# Altium schematic sheet ALU_Adder.SchDoc
size B; Author: E. Sims; Organization: Let's Build Rockets Inc.; SheetNumber: 18; SheetTotal: 18
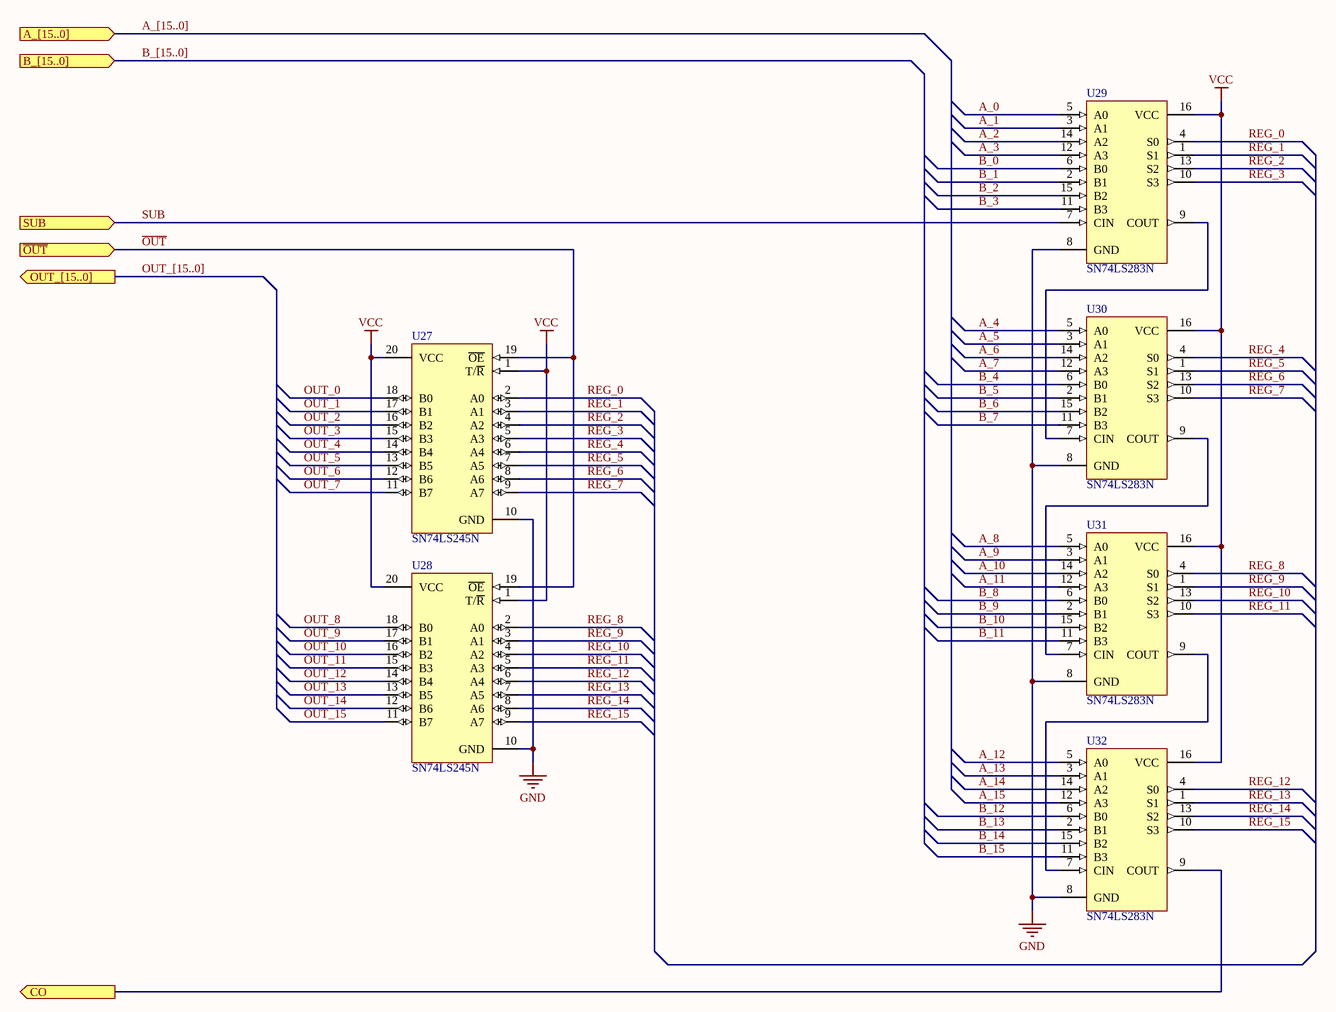
[diagram p0: ALU_Adder.SchDoc]

## Parts
U27  SN74LS245N  [N020]
U28  SN74LS245N  [N020]
U29  SN74LS283N  [W016]
U30  SN74LS283N  [W016]
U31  SN74LS283N  [W016]
U32  SN74LS283N  [W016]

## Ports
A_[15..0] (in), B_[15..0] (in), CO (out), OUT_[15..0] (out), SUB (in), ~{OUT} (in)

## Nets
GND: U27.10(GND) U28.10(GND) U29.8(GND) U30.8(GND) U31.8(GND) U32.8(GND)
VCC: U27.1(T/~{R}) U27.20(VCC) U28.1(T/~{R}) U28.20(VCC) U29.16(VCC) U30.16(VCC) U31.16(VCC) U32.16(VCC)
A_0: U29.5(A0)
A_1: U29.3(A1)
A_2: U29.14(A2)
A_3: U29.12(A3)
A_4: U30.5(A0)
A_5: U30.3(A1)
A_6: U30.14(A2)
A_7: U30.12(A3)
A_8: U31.5(A0)
A_9: U31.3(A1)
A_10: U31.14(A2)
A_11: U31.12(A3)
A_12: U32.5(A0)
A_13: U32.3(A1)
A_14: U32.14(A2)
A_15: U32.12(A3)
B_0: U29.6(B0)
B_1: U29.2(B1)
B_2: U29.15(B2)
B_3: U29.11(B3)
B_4: U30.6(B0)
B_5: U30.2(B1)
B_6: U30.15(B2)
B_7: U30.11(B3)
B_8: U31.6(B0)
B_9: U31.2(B1)
B_10: U31.15(B2)
B_11: U31.11(B3)
B_12: U32.6(B0)
B_13: U32.2(B1)
B_14: U32.15(B2)
B_15: U32.11(B3)
CO: U32.9(COUT) ; port CO
~{OUT}: U27.19(~{OE}) U28.19(~{OE}) ; port ~{OUT}
OUT_0: U27.18(B0)
OUT_1: U27.17(B1)
OUT_2: U27.16(B2)
OUT_3: U27.15(B3)
OUT_4: U27.14(B4)
OUT_5: U27.13(B5)
OUT_6: U27.12(B6)
OUT_7: U27.11(B7)
OUT_8: U28.18(B0)
OUT_9: U28.17(B1)
OUT_10: U28.16(B2)
OUT_11: U28.15(B3)
OUT_12: U28.14(B4)
OUT_13: U28.13(B5)
OUT_14: U28.12(B6)
OUT_15: U28.11(B7)
REG_0: U27.2(A0) U29.4(S0)
REG_1: U27.3(A1) U29.1(S1)
REG_2: U27.4(A2) U29.13(S2)
REG_3: U27.5(A3) U29.10(S3)
REG_4: U27.6(A4) U30.4(S0)
REG_5: U27.7(A5) U30.1(S1)
REG_6: U27.8(A6) U30.13(S2)
REG_7: U27.9(A7) U30.10(S3)
REG_8: U28.2(A0) U31.4(S0)
REG_9: U28.3(A1) U31.1(S1)
REG_10: U28.4(A2) U31.13(S2)
REG_11: U28.5(A3) U31.10(S3)
REG_12: U28.6(A4) U32.4(S0)
REG_13: U28.7(A5) U32.1(S1)
REG_14: U28.8(A6) U32.13(S2)
REG_15: U28.9(A7) U32.10(S3)
SUB: U29.7(CIN) ; port SUB
NetU29_9: U29.9(COUT) U30.7(CIN)
NetU30_9: U30.9(COUT) U31.7(CIN)
NetU31_9: U31.9(COUT) U32.7(CIN)

## Buses and harness runs
bus A_[15..0] = port A_[15..0]
bus B_[15..0] = port B_[15..0]
bus OUT_[15..0] = port OUT_[15..0]

## Notes on the sheet
- Let's Build Rocket's Inc. Modular Paylaod System Based on TMP-010 Rev
  For more information visit https://github.com/LetsBuildRockets/Modular-Payload-System
  This work is licensed under CC BY-NC 4.0. To view a copy of this license, visit https://creativecommons.org/licenses/by-nc/4.0
- Title
- Size:
- Date:
- Assembly Variant:
- B
- Number:
- Time:
- Revision:
- Sheet
- of
- Author:
- File:

## Library data of the parts
U27 U28 = SN74LS245N: Octal Bus Transceiver with 3-State Outputs; Published: 8-Jun-2000; LatestRevisionDate: 04-Mar-2005; LatestRevisionNote: Stylized 3D Model Added.; DatasheetVersion: Mar-1988; PackageVersion: Oct-1995; PackageReference: N020; Publisher: Altium Limited; PackageDescription: DIP; 20 Leads; Row Spacing 7.62 mm; Pitch 2.54 mm; ComponentLink1Description: Manufacturer Link; ComponentLink1URL: http://www.ti.com/; ComponentLink2Description: Datasheet; ComponentLink2URL: http://www-s.ti.com/sc/ds/sn74ls245.pdf
U29-U32 = SN74LS283N: 4-Bit Binary Full Adder with Fast Carry; Published: 8-Jun-2000; LatestRevisionDate: 04-Mar-2005; LatestRevisionNote: Stylized 3D Model Added.; DatasheetVersion: Mar-1988; PackageVersion: Jan-1995; PackageReference: W016; Publisher: Altium Limited; PackageDescription: DFP; 16 Leads; Body 10.9 x 7.2 mm (LxW max); Pitch 1.27 mm; ComponentLink1Description: Manufacturer Link; ComponentLink1URL: http://www.ti.com; ComponentLink2Description: Datasheet; ComponentLink2URL: http://www-s.ti.com/sc/ds/sn54ls283.pdf; Code_JEDEC: MO-092-AC